# Altium schematic sheet PowerSupplies.SchDoc
size A; SheetNumber: 3; SheetTotal: 10
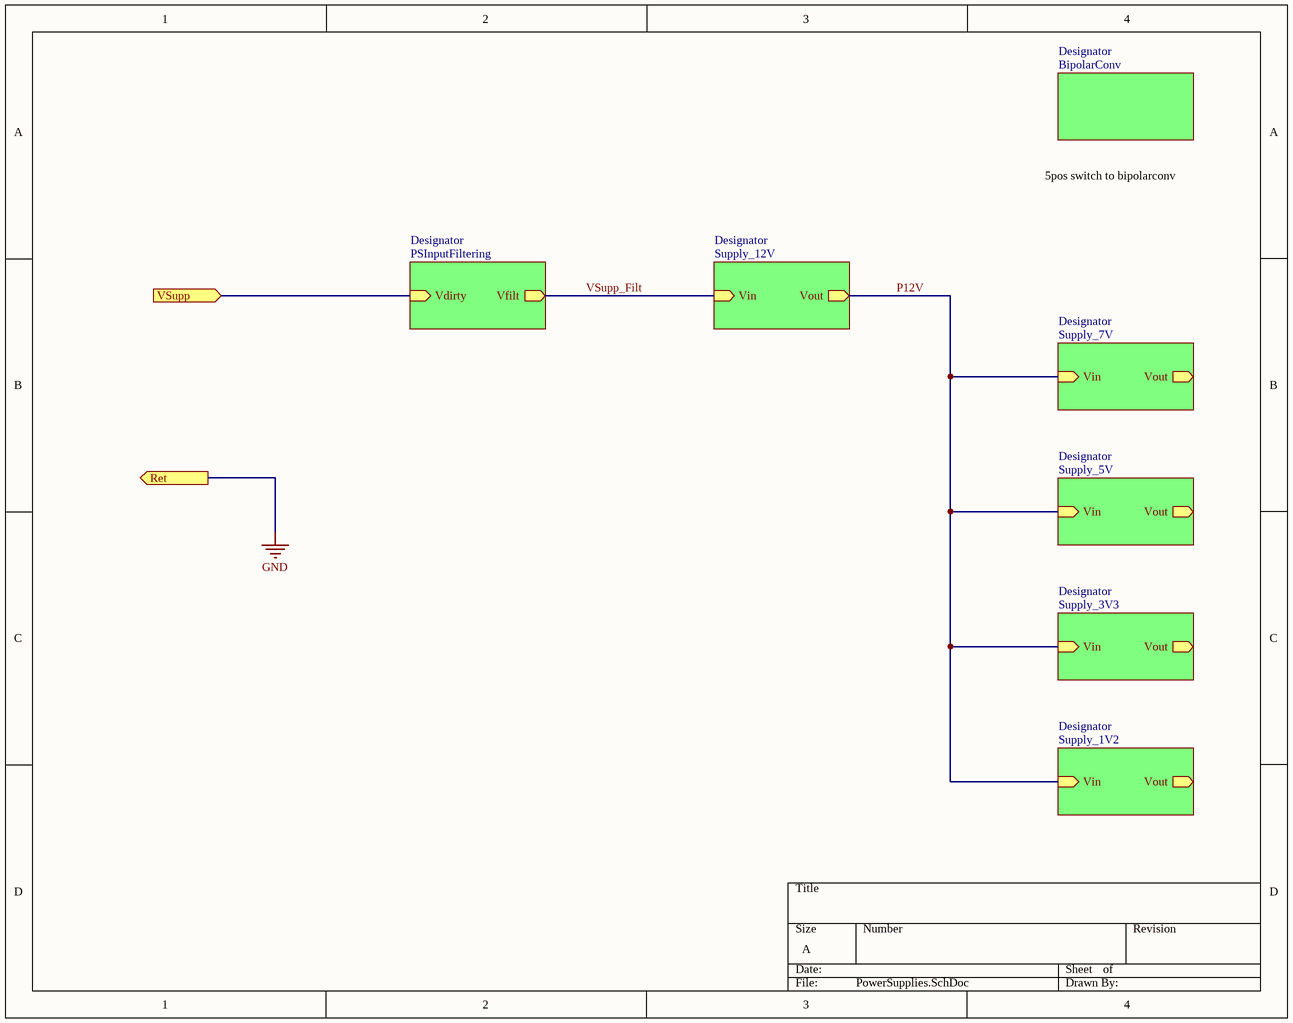
[diagram p0: PowerSupplies.SchDoc]

## Sub-sheets
Designator = BipolarConv: no entries
Designator = Supply_12V: Vout (out), Vin (in)
Designator = Supply_7V: Vout (out), Vin (in)
Designator = Supply_5V: Vin (in), Vout (out)
Designator = Supply_3V3: Vin (in), Vout (out)
Designator = Supply_1V2: Vin (in), Vout (out)
Designator = PSInputFiltering: Vdirty (in), Vfilt (out)

## Ports
Ret (out), VSupp (in)

## Nets
GND: port Ret
P12V: sheet Designator/Vout, sheet Designator/Vin, sheet Designator/Vin, sheet Designator/Vin, sheet Designator/Vin
VSupp: port VSupp, sheet Designator/Vdirty
VSupp_Filt: sheet Designator/Vin, sheet Designator/Vfilt

## Notes on the sheet
- 5pos switch to bipolarconv